# Altium schematic sheet Конвертер USB-RS232 v1.0.SchDoc
size 420 x 297 mm; SheetNumber: 1; SheetTotal: 1
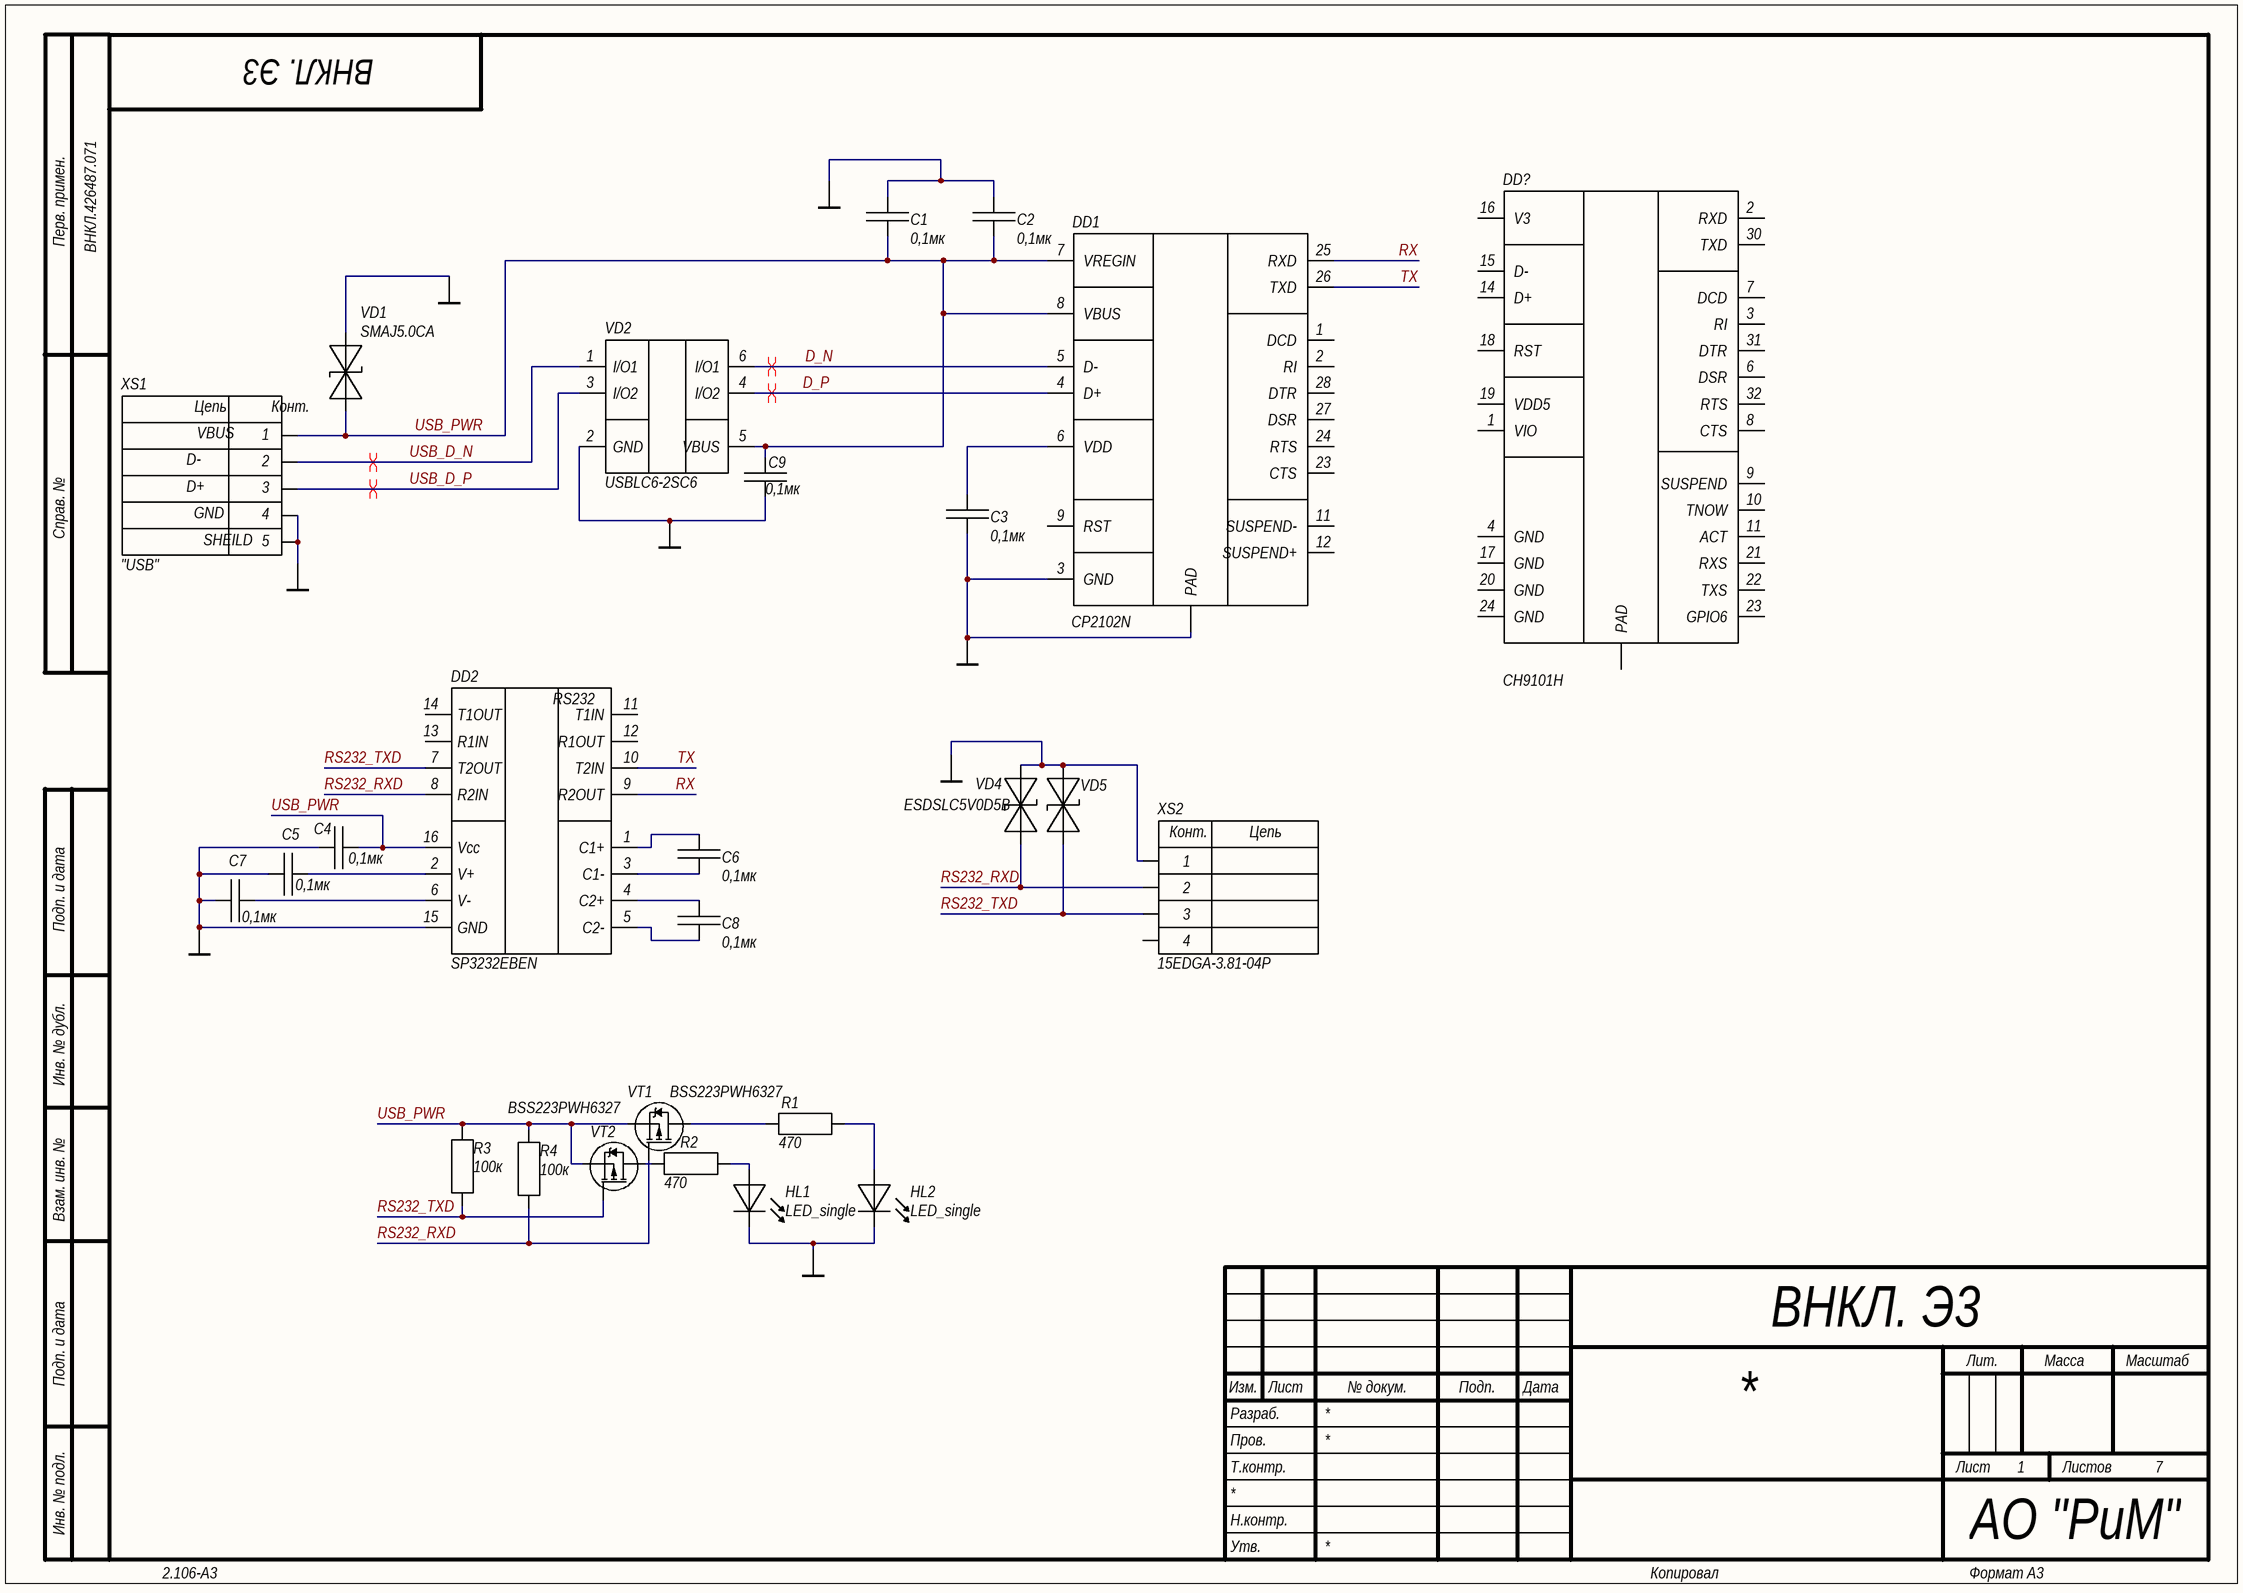
[diagram p0: Конвертер USB-RS232 v1.0.SchDoc]

## Parts
C1  0,1мк  [CAP: 0402]
C2  0,1мк  [CAP: 0402]
C3  0,1мк  [CAP: 0402]
C4  0,1мк  [CAP: 0402]
C5  0,1мк  [CAP: 0402]
C6  0,1мк  [CAP: 0402]
C7  0,1мк  [CAP: 0402]
C8  0,1мк  [CAP: 0402]
C9  0,1мк  [CAP: 0402]
DD1  CP2102N  [28-QFN (5x5)]
DD2  SP3232EBEN  [16-SO]
DD?  CH9101H  [32-QFN]
HL1  LED_single  [LED: 0603G]
HL2  LED_single  [LED: 0603G]
R1  470  [RES: 0402]
R2  470  [RES: 0402]
R3  100к  [RES: 0402]
R4  100к  [RES: 0402]
VD1  SMAJ5.0CA  [DIODE: SMA]
VD2  USBLC6-2SC6  [SOT23-6]
VD4  ESDSLC5V0D5B  [DIODE: SOD523]  (value not drawn)
VD5  ESDSLC5V0D5B  [DIODE: SOD523]
VT1  BSS223PWH6327  [SOT-323]
VT2  BSS223PWH6327  [SOT-323]
XS1  CommentText: "USB"  [CON: USB-B-R]
XS2  15EDGA-3.81-04P  [CON: 15EDGA-3.81-04P]

## Nets
GND_RS1: C1.1 C2.1 C3.2 C4.1 C5.1 C7.1 C9.1 DD1.0(PAD) DD1.3(GND) DD2.15(GND) HL1.2(C) HL2.2(C) VD1.1(A) VD2.2(GND) VD4.1(A) VD5.1(A) XS1.4 XS1.5 XS2.1
D_N: DD1.5(D-) VD2.6(I/O1)
D_P: DD1.4(D+) VD2.4(I/O2)
RS232_RXD: DD2.8(R2IN) R4.1 VD4.2(C) VT1.1(G) XS2.2
RS232_TXD: DD2.7(T2OUT) R3.1 VD5.2(C) VT2.1(G) XS2.3
RX: DD1.25(RXD) DD2.9(R2OUT)
TX: DD1.26(TXD) DD2.10(T2IN)
USB_D_N: VD2.1(I/O1) XS1.2
USB_D_P: VD2.3(I/O2) XS1.3
USB_PWR: C1.2 C2.2 C4.2 C9.2 DD1.7(VREGIN) DD1.8(VBUS) DD2.16(Vcc) R3.2 R4.2 VD1.2(C) VD2.5(VBUS) VT1.2(S) VT2.2(S) XS1.1
NetC3_1: C3.1 DD1.6(VDD)
NetC5_2: C5.2 DD2.2(V+)
NetC6_1: C6.1 DD2.3(C1-)
NetC6_2: C6.2 DD2.1(C1+)
NetC7_2: C7.2 DD2.6(V-)
NetC8_1: C8.1 DD2.5(C2-)
NetC8_2: C8.2 DD2.4(C2+)
NetHL1_1: HL1.1(A) R2.2
NetHL2_1: HL2.1(A) R1.2
NetR1_1: R1.1 VT1.3(D)
NetR2_1: R2.1 VT2.3(D)

Not connected (* = marked no-connect by the designer): DD1 1(DCD) 2(RI) 9(RST) 11(SUSPEND-) 12(SUSPEND+) 23(CTS) 24(RTS) 27(DSR) 28(DTR); DD2 11(T1IN) 12(R1OUT) 13(R1IN) 14(T1OUT); DD? 0(PAD) 1(VIO) 2(RXD) 3(RI) 4(GND) 6(DSR) 7(DCD) 8(CTS) 9(SUSPEND) 10(TNOW) 11(ACT) 14(D+) 15(D-) 16(V3) 17(GND) 18(RST) 19(VDD5) 20(GND) 21(RXS) 22(TXS) 23(GPIO6) 24(GND) 30(TXD) 31(DTR) 32(RTS); XS2 4

## Layout directives
differential pair: D_N, D_P, USB_D_N, USB_D_P

## Notes on the sheet
- ВНКЛ. Э3
- ВНКЛ.426487.071
- Перв. примен.
- Справ. №
- Подп. и дата
- Инв. № дубл.
- Взам. инв. №
- Разраб.
- Изм.
- Лист
- № докум.
- Подп.
- Дата
- Лит.
- Масса
- Масштаб
- Пров.
- Т.контр.
- Листов
- 7
- Инв. № подл.
- Утв.
- Н.контр.
- АО "РиМ"
- 2.106-A3
- Копировал
- Формат А3
- (in symbol 15EDGA-3.81-04P) Конт.; Цепь
- (in symbol SP3232EB) RS232
- (in symbol USB_B) Цепь; Конт.; VBUS; D-; D+; GND; SHEILD

## Library data of the parts
C1-C9 = Ceramic_0402: Наименование: 0402 X7R 25В 0,1 мкФ ±10%; Примечание: SMD
DD1 = CP2102N: USB2.0-to-UART; Примечание: SMD; Наименование: CP2102N
DD2 = SP3232EB: RS-232; Примечание: SMD; Наименование: SP3232EBEN
DD? = CH9101H: USB2.0-to-UART; Примечание: SMD; Наименование: CH9101H
HL1 HL2 = LED_single: Наименование: FYLS-0603UGC; Примечание: SMD
R1 R2 = Resistor_0402: Наименование: 0402 470 Ом ±1%; Примечание: SMD
R3 R4 = Resistor_0402: Наименование: 0402 100 кОм ±1%; Примечание: SMD
VD1 VD4 VD5 = TVS_single: Примечание: SMD
  VD1: Наименование: SMAJ5.0CA
  VD4 VD5: Наименование: ESDSLC5V0D5B
VD2 = USBLC6-2SC6: Примечание: SMD; Наименование: USBLC6-2SC6
VT1 VT2 = MOSFET_P_132: Примечание: SMD; Наименование: BSS223PWH6327
XS1 = USB_B: Manufacturer: Molex; ValueManufacturerPartNumber: USB mini B; PartNumber: 0675031020; Наименование: USB-B; HelpURL: https://www.digikey.com/product-detail/en/molex/0675031020/WM5461CT-ND/1624427; TypeConnector: USB mini B; Примечание: *
XS2 = 15EDGA-3.81-04P: Наименование: 15EDGA-3.81-04P